# Altium schematic sheet SH17 - USER SWITCHES_LE.SchDoc
size 386 x 246 mm
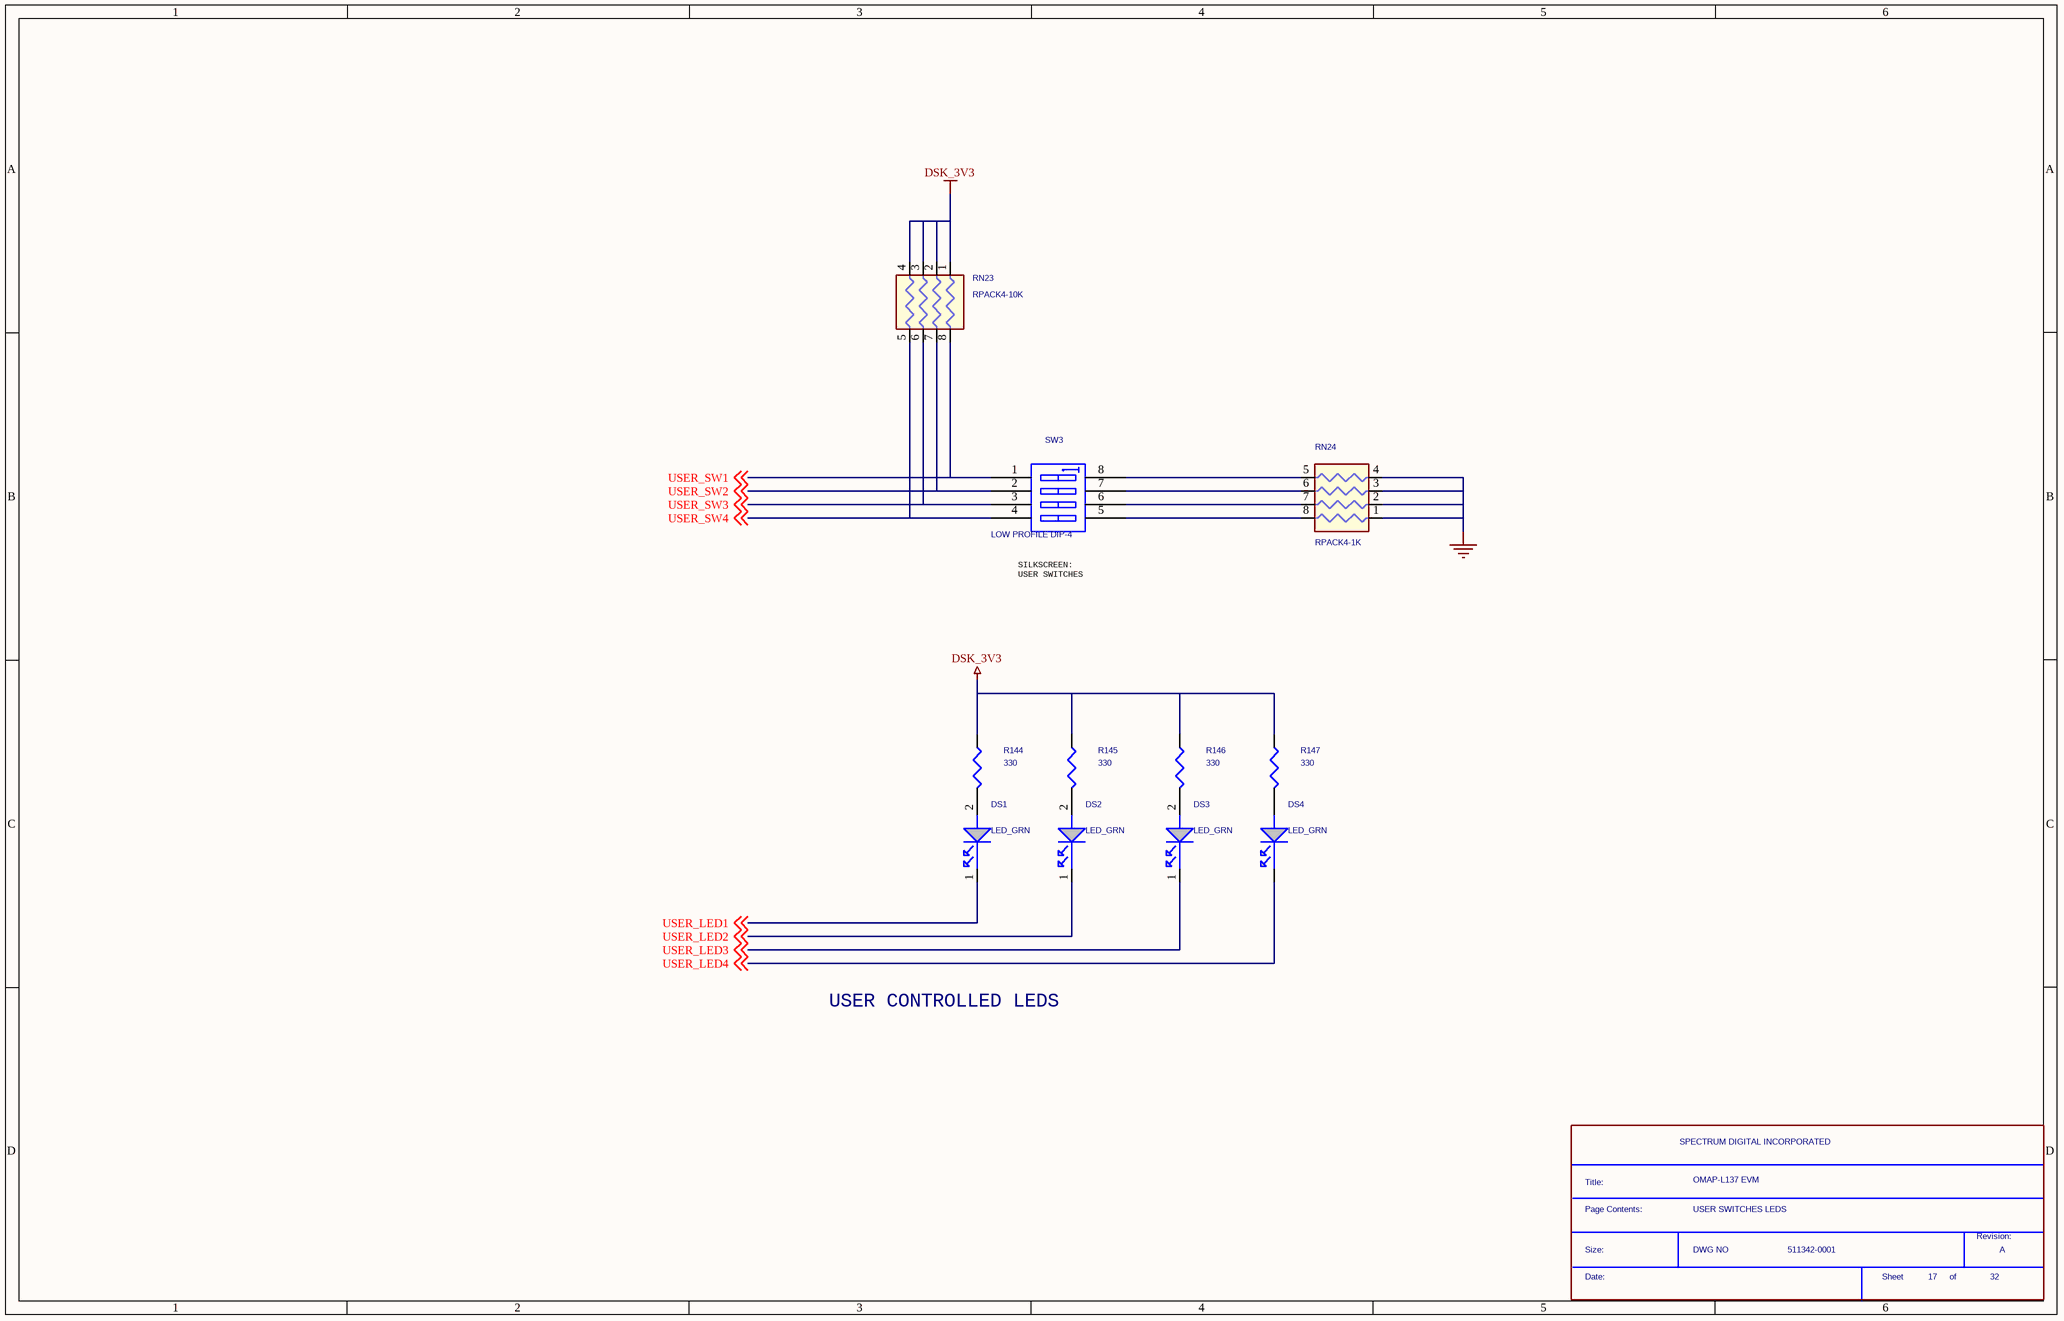
[diagram p0: SH17 - USER SWITCHES_LE.SchDoc]

## Parts
*  Page Contents:: USER SWITCHES LEDS  RevCode: A  Title: OMAP-L137 EVM  OrgName: SPECTRUM DIGITAL INCORPORATED  Doc: 511342-0001  Page Number: 17  Page Count: 32  (hidden comment: SDTitleBlock)  (graphical)
DS1  LED_GRN  [led1206-59x59]
DS2  LED_GRN  [led1206-59x59]
DS3  LED_GRN  [led1206-59x59]
DS4  LED_GRN  [led1206-59x59]
R144  330  [r402-25]
R145  330  [r402-25]
R146  330  [r402-25]
R147  330  [r402-25]
RN23  RPACK4-10K  [rpak8-10x25-28v]
RN24  RPACK4-1K  [rpak8-10x25-28v]
SW3  LOW PROFILE DIP-4  [sw4-44x96-cts]

## Nets
DSK_3V3: R144.1 R145.1 R146.1 R147.1 RN23.1(R1A) RN23.2(R2A) RN23.3(R3A) RN23.4(R4A)
GND: RN24.1(R1A) RN24.2(R2A) RN24.3(R3A) RN24.4(R4A)
USER_LED1: DS1.1(CATHODE) ; off-sheet USER_LED1
USER_LED2: DS2.1(CATHODE) ; off-sheet USER_LED2
USER_LED3: DS3.1(CATHODE) ; off-sheet USER_LED3
USER_LED4: DS4.1(cathode) ; off-sheet USER_LED4
USER_SW1: RN23.8(R1B) SW3.1(A1) ; off-sheet USER_SW1
USER_SW2: RN23.7(R2B) SW3.2(A2) ; off-sheet USER_SW2
USER_SW3: RN23.6(R3B) SW3.3(A3) ; off-sheet USER_SW3
USER_SW4: RN23.5(R4B) SW3.4(A4) ; off-sheet USER_SW4
NetDS1_2: DS1.2(ANODE) R144.2
NetDS2_2: DS2.2(ANODE) R145.2
NetDS3_2: DS3.2(ANODE) R146.2
NetDS4_2: DS4.2(ANODE) R147.2
NetRN24_5: RN24.5(R4B) SW3.8(B1)
NetRN24_6: RN24.6(R3B) SW3.7(B2)
NetRN24_7: RN24.7(R2B) SW3.6(B3)
NetRN24_8: RN24.8(R1B) SW3.5(B4)

## Notes on the sheet
- (near SW3) SILKSCREEN:
  USER SWITCHES
- USER CONTROLLED LEDS
- (in symbol SDTitleBlock) Title:; Page Contents:; Revision:; Size:; DWG NO; Date:; Sheet; of

## Library data of the parts
DS1-DS3 = LED_0: LEDs (green); Part #: 100823-0001R; Mfgr Nbr: LTST-C150GKT; Mfgr: Lite-on
DS4 = LED_RED_0: LEDs (green); Part #: 100823-0001R; Mfgr: Lite-on; Mfgr Nbr: LTST-C150GKT
R144-R147 = R_0: Part #: 101370-3301R
RN23 = R-Pak4: Part #: 101327-1003R
RN24 = R-Pak4: Part #: 101327-1002R
SW3 = SW DIP-4_0: Part #: 100584-0004R